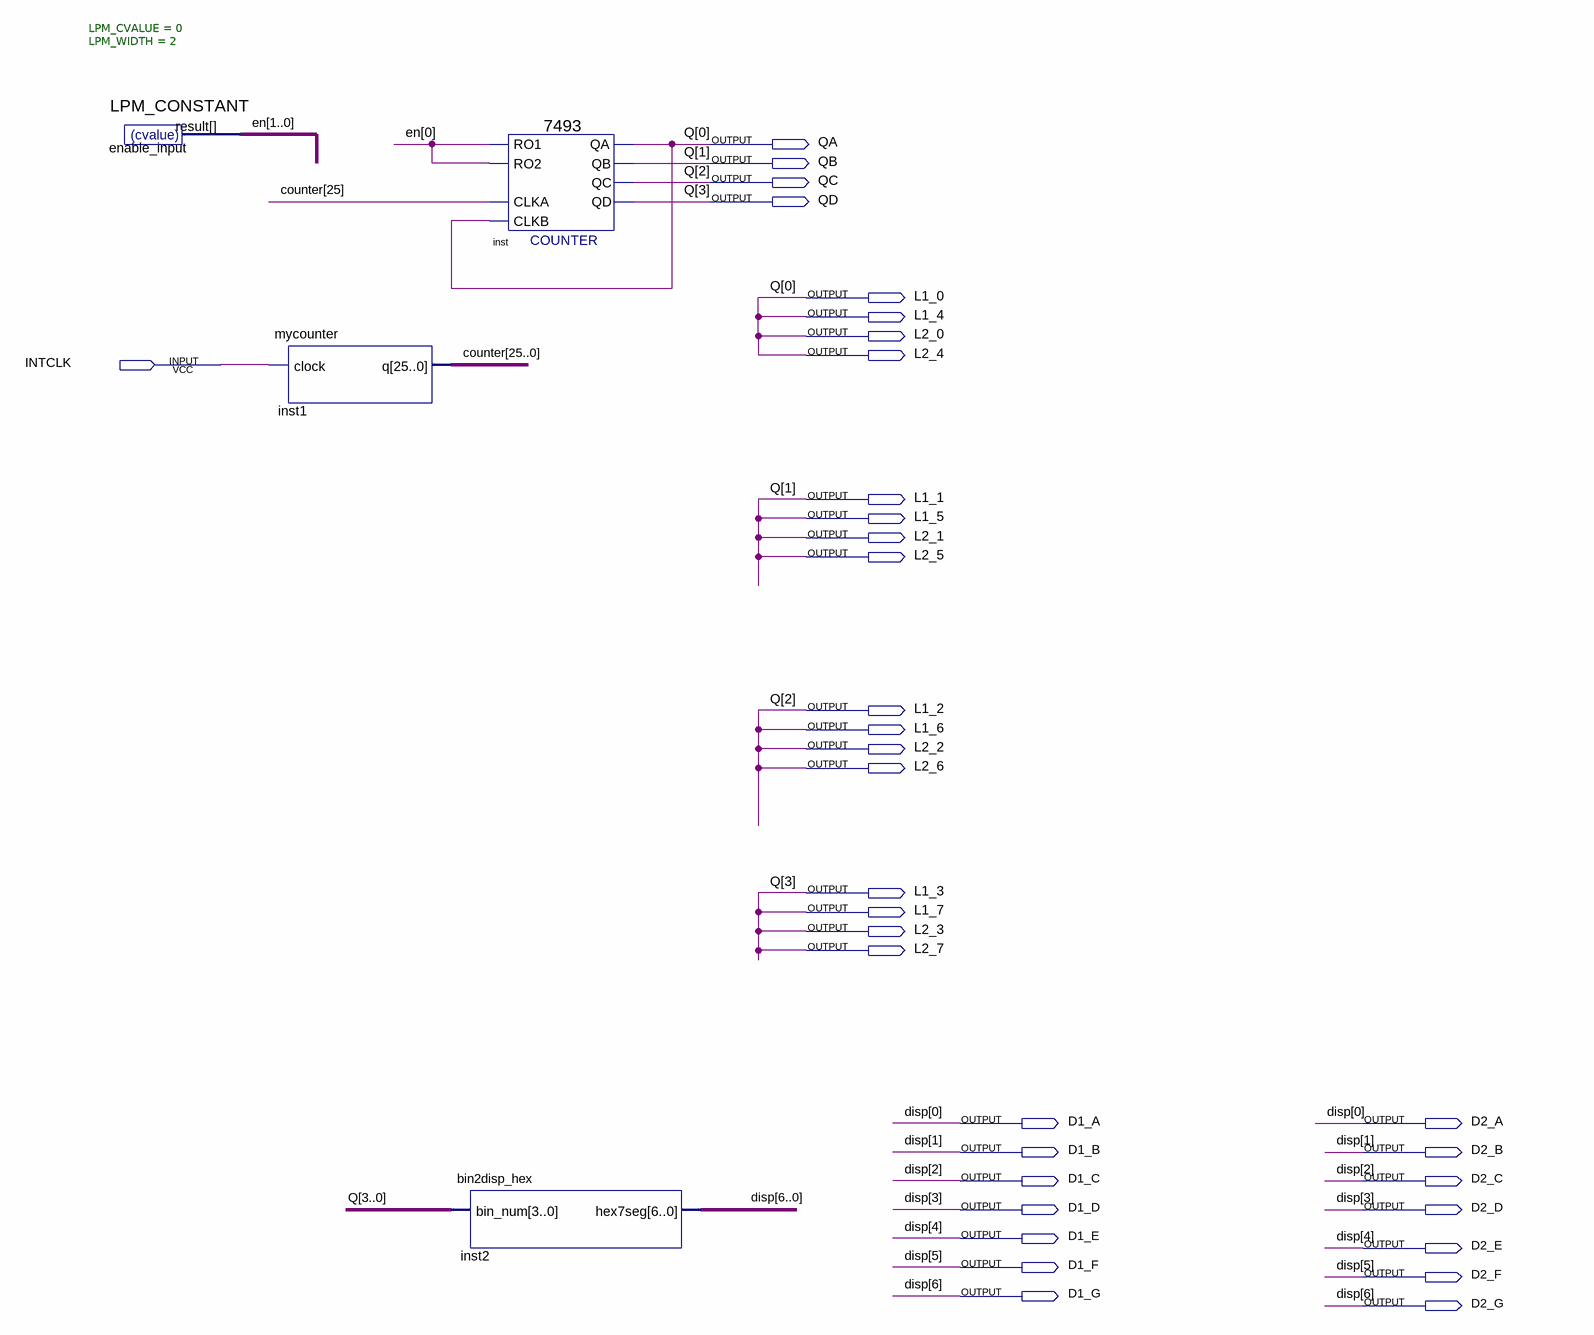
[diagram p0: schematic sheet]
// Quartus schematic Block1.bdf as structural Verilog: 4 symbols, 35 pins
module Block1 (
  input  INTCLK,
  output QA,
  output QB,
  output QC,
  output QD,
  output L1_0,
  output L1_4,
  output L2_0,
  output L2_4,
  output L1_1,
  output L1_5,
  output L2_1,
  output L2_5,
  output L1_2,
  output L1_6,
  output L2_2,
  output L2_6,
  output L1_3,
  output L1_7,
  output L2_3,
  output L2_7,
  output D1_A,
  output D2_A,
  output D1_B,
  output D2_B,
  output D1_C,
  output D2_C,
  output D1_D,
  output D2_D,
  output D1_E,
  output D2_E,
  output D1_F,
  output D2_F,
  output D1_G,
  output D2_G
);

  wire [1:0] en;
  wire [25:0] counter;

  LPM_CONSTANT #(.LPM_CVALUE(0), .LPM_WIDTH(2)) enable_input (.result(en));
  mycounter inst1 (.clock(INTCLK), .q(counter));
  \7493  inst (.RO1(en[0]), .RO2(en[0]), .CLKA(counter[25]), .CLKB(L1_0), .QC(L1_2), .QB(L1_1), .QA(L1_0), .QD(L1_3));
  bin2disp_hex inst2 (.bin_num({L1_3, L1_2, L1_1, L1_0}), .hex7seg({D1_G, D1_F, D1_E, D1_D, D1_C, D1_B, D1_A}));

  assign D2_A = D1_A;
  assign D2_B = D1_B;
  assign D2_C = D1_C;
  assign D2_D = D1_D;
  assign D2_E = D1_E;
  assign D2_F = D1_F;
  assign D2_G = D1_G;
  assign L1_4 = L1_0;
  assign L1_5 = L1_1;
  assign L1_6 = L1_2;
  assign L1_7 = L1_3;
  assign L2_0 = L1_0;
  assign L2_1 = L1_1;
  assign L2_2 = L1_2;
  assign L2_3 = L1_3;
  assign L2_4 = L1_0;
  assign L2_5 = L1_1;
  assign L2_6 = L1_2;
  assign L2_7 = L1_3;
  assign QA = L1_0;
  assign QB = L1_1;
  assign QC = L1_2;
  assign QD = L1_3;

  // Other names for the same wires on the sheet: disp[6:0] = {D1_G, D1_F, D1_E, D1_D, D1_C, D1_B, D1_A};
  //   Q[3:0] = {L1_3, L1_2, L1_1, L1_0}
endmodule
